# EAGLE design WaterMonitorV7.0 (EAGLE 7.4.0)
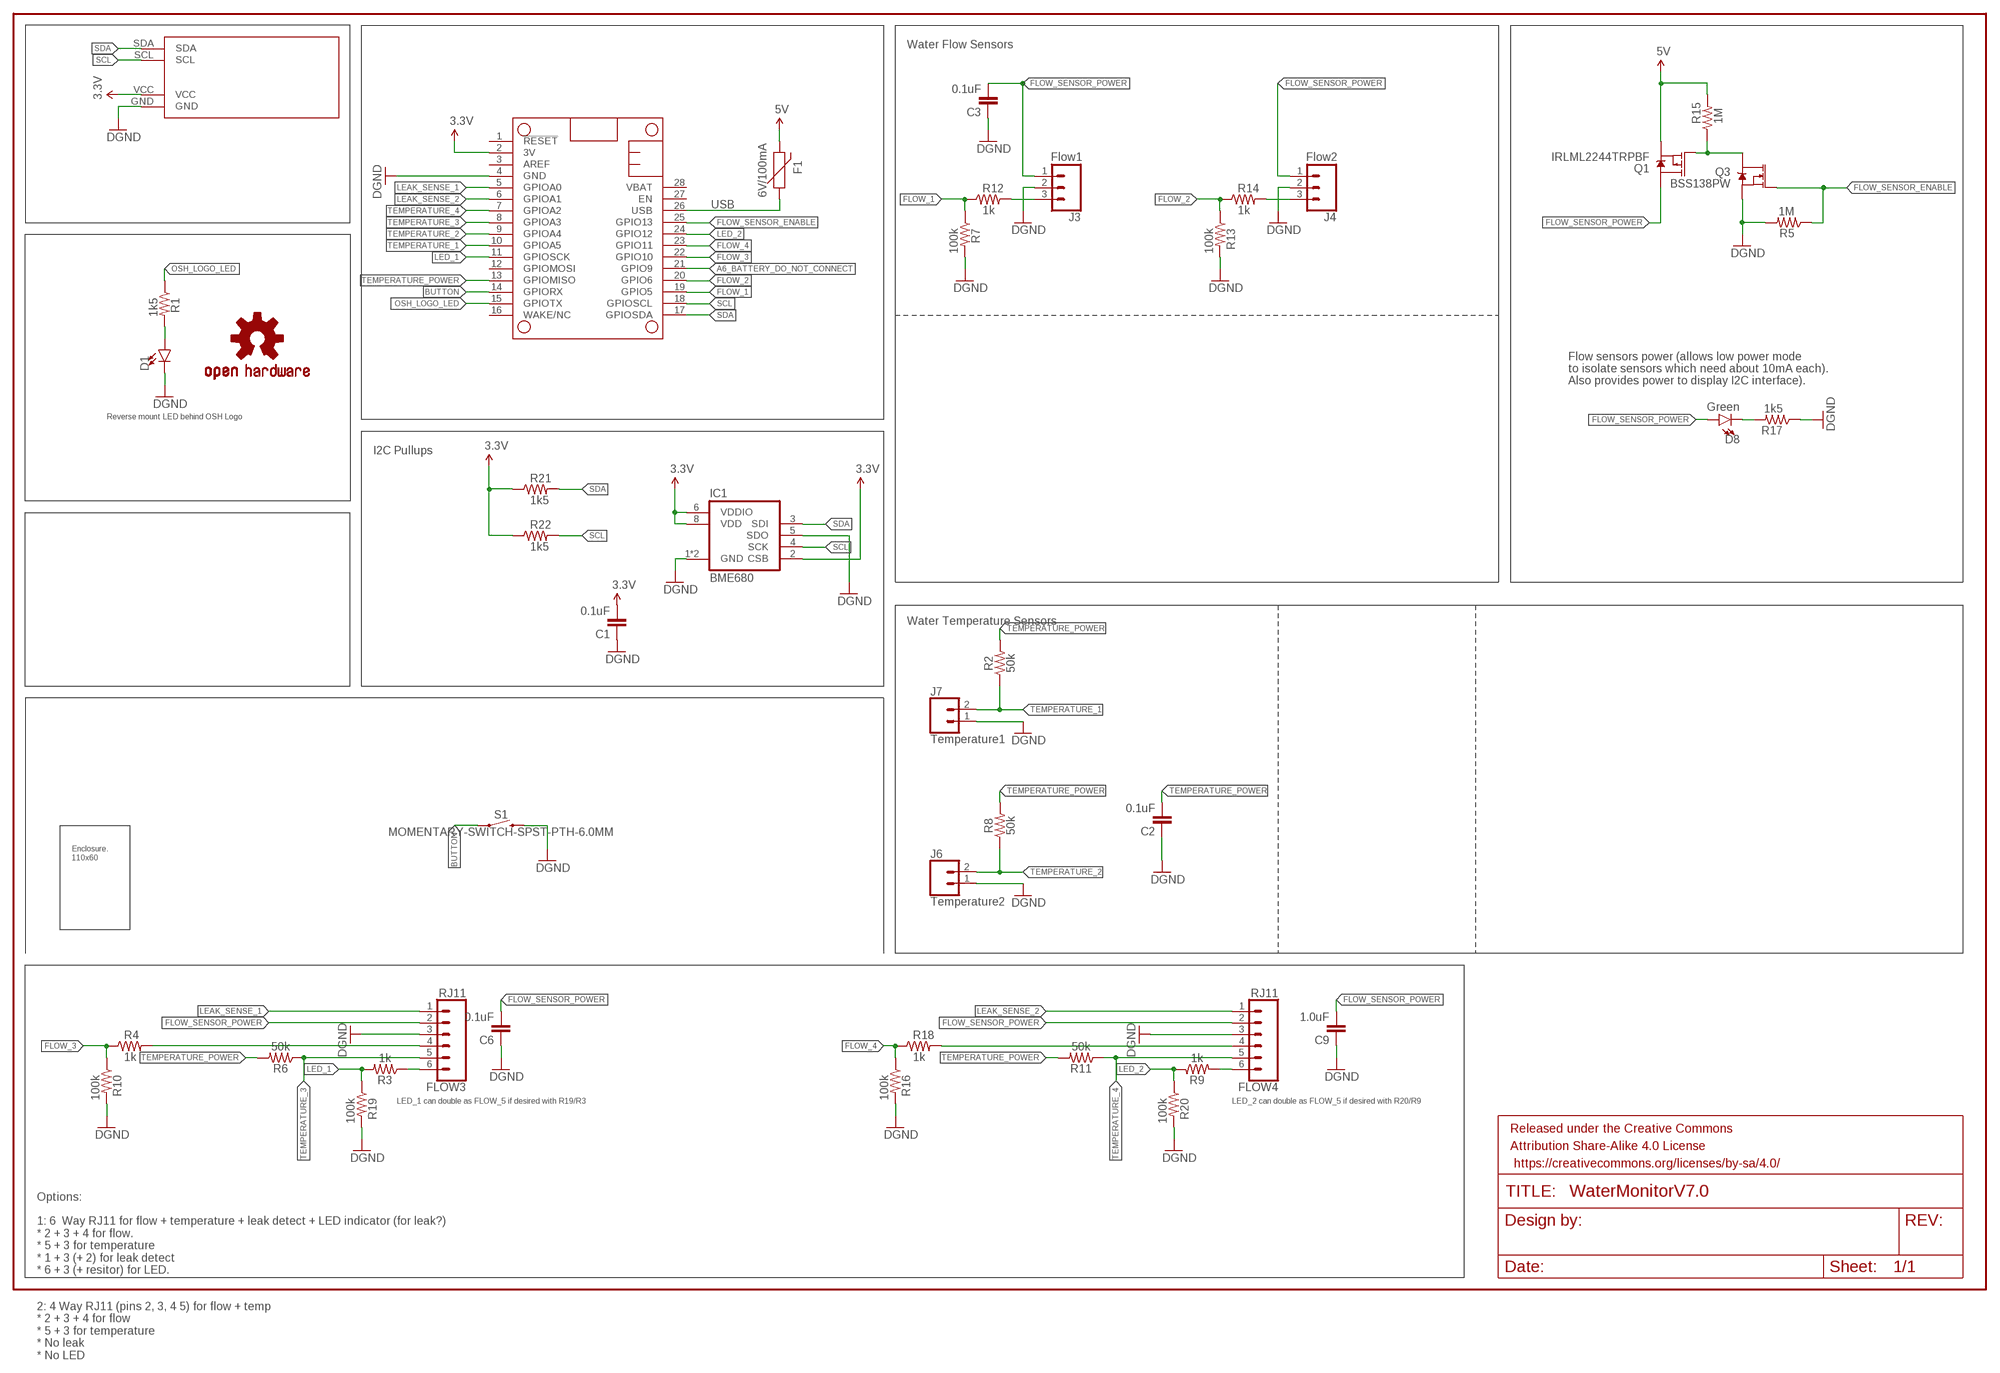
[diagram p0: schematic, sheet 1]

## Parts
C1  0.1uF  CAP0805  [0805]
C2  0.1uF  CAP0805  [0805]
C3  0.1uF  CAP0805  [0805]
C6  0.1uF  CAP0805  [0805]
C9  1.0uF  CAP0805  [0805]
D1  LED1206-BOTTOM  [LED-1206-BOTTOM]
D8  Green  LED-BLUE1206  [LED-1206]
F1  6V/100mA  PPTC_HALF-AMP  [1206]
FLOW3  RJ11  RJ11-6  [RJ11-6]
FLOW4  RJ11  RJ11-6  [RJ11-6]
FRAME2  FRAME-LEDGER  [CREATIVE_COMMONS]
IC1  BME680  [BME680]
J3  Flow1  CONN_03JST-HX-PTH-VERT  [JST-HX-3-PTH-VERT]
J4  Flow2  CONN_03JST-HX-PTH-VERT  [JST-HX-3-PTH-VERT]
J6  Temperature2  CONN_02POLAR  [MOLEX-1X2]
J7  Temperature1  CONN_02POLAR  [MOLEX-1X2]
LOGO1  OSHW-LOGOM  [OSHW-LOGO-M]
MS1  FEATHERWINGSIMPLE  [FEATHERWING_BREAKOUT_SIMPLE]
Q1  IRLML2244TRPBF  MOSFET_PCH-IRLML2244  [SOT23-3]
Q3  BSS138PW  MOSFET-NCH-BSS138  [SOT23-3]
R1  1k5  RESISTOR0805  [0805]
R2  50k  RESISTOR0805  [0805]
R3  1k  RESISTOR0805  [0805]
R4  1k  RESISTOR0805  [0805]
R5  1M  RESISTOR0805  [0805]
R6  50k  RESISTOR0805  [0805]
R7  100k  RESISTOR0805  [0805]
R8  50k  RESISTOR0805  [0805]
R9  1k  RESISTOR0805  [0805]
R10  100k  RESISTOR0805  [0805]
R11  50k  RESISTOR0805  [0805]
R12  1k  RESISTOR0805  [0805]
R13  100k  RESISTOR0805  [0805]
R14  1k  RESISTOR0805  [0805]
R15  1M  RESISTOR0805  [0805]
R16  100k  RESISTOR0805  [0805]
R17  1k5  RESISTOR0805  [0805]
R18  1k  RESISTOR0805  [0805]
R19  100k  RESISTOR0805  [0805]
R20  100k  RESISTOR0805  [0805]
R21  1k5  RESISTOR0805  [0805]
R22  1k5  RESISTOR0805  [0805]
S1  MOMENTARY-SWITCH-SPST-PTH-6.0MM  [TACTILE_SWITCH_PTH_6.0MM]
U$1  CAMDENBOSS-ENCLOSURE-110X60BOTH-EXTENDED-WIDE  [CAMDENBOSS_ENCLOSURE_110X60_WIDE_EXTENDED]
U$2  DISPLAY0.96_INCH_DISPLAY  [I2C_DISPLAY_0.96_INCH]

## Nets
3.3V: C1.2 IC1.2(CSB) IC1.6(VDDIO) IC1.8(VDD) MS1.2(3V) R21.1 R22.1 U$2.VCC
5V: F1.2 Q1.2(S) R15.2
A6_BATTERY_DO_NOT_CONNECT: MS1.21(GPIO9)
BUTTON: MS1.14(GPIORX) S1.1
FLOW_1: MS1.19(GPIO5) R7.1 R12.1
FLOW_2: MS1.20(GPIO6) R13.1 R14.1
FLOW_3: MS1.22(GPIO10) R4.1 R10.1
FLOW_4: MS1.23(GPIO11) R16.1 R18.1
FLOW_SENSOR_ENABLE: MS1.25(GPIO13) Q3.1(G) R5.1
FLOW_SENSOR_POWER: C3.2 C6.2 C9.2 D8.A FLOW3.2 FLOW4.2 J3.1 J4.1 Q1.3(D)
GND: C1.1 C2.1 C3.1 C6.1 C9.1 D1.C FLOW3.3 FLOW4.3 IC1.1(GND) IC1.5(SDO) IC1.7(GND) J3.2 J4.2 J6.1 J7.1 MS1.4(GND) Q3.2(S) R5.2 R7.2 R10.2 R13.2 R16.2 R17.1 R19.2 R20.2 S1.3 U$2.GND ; supply symbol labelled DGND
LEAK_SENSE_1: FLOW3.1 MS1.5(GPIOA0)
LEAK_SENSE_2: FLOW4.1 MS1.6(GPIOA1)
LED_1: MS1.11(GPIOSCK) R3.2 R19.1
LED_2: MS1.24(GPIO12) R9.1 R20.1
N$1: J3.3 R12.2
N$3: FLOW4.4 R18.2
N$4: FLOW3.4 R4.2
N$6: J4.3 R14.2
N$7: D8.C R17.2
N$11: FLOW3.6 R3.1
N$16: FLOW4.6 R9.2
N$19: Q1.1(G) Q3.3(D) R15.1
N$21: D1.A R1.2
OSH_LOGO_LED: MS1.15(GPIOTX) R1.1
SCL: IC1.4(SCK) MS1.18(GPIOSCL) R22.2 U$2.SCL
SDA: IC1.3(SDI) MS1.17(GPIOSDA) R21.2 U$2.SDA
TEMPERATURE_1: J7.2 MS1.10(GPIOA5) R2.1
TEMPERATURE_2: J6.2 MS1.9(GPIOA4) R8.1
TEMPERATURE_3: FLOW3.5 MS1.8(GPIOA3) R6.1
TEMPERATURE_4: FLOW4.5 MS1.7(GPIOA2) R11.1
TEMPERATURE_POWER: C2.2 MS1.13(GPIOMISO) R2.2 R6.2 R8.2 R11.2
USB: F1.1 MS1.26(USB)
Unconnected: MS1.1(!RESET) MS1.3(AREF) MS1.12(GPIOMOSI) MS1.16(WAKE/NC) MS1.27(EN) MS1.28(VBAT)

## Notes on the sheet
- Water Flow Sensors
- Flow sensors power (allows low power mode 
  to isolate sensors which need about 10mA each).
  Also provides power to display I2C interface).
- Reverse mount LED behind OSH Logo
- I2C Pullups
- Water Temperature Sensors
- LED_1 can double as FLOW_5 if desired with R19/R3 | LED_2 can double as FLOW_5 if desired with R20/R9
- Options:
  
  1: 6  Way RJ11 for flow + temperature + leak detect + LED indicator (for leak?)
  * 2 + 3 + 4 for flow.
  * 5 + 3 for temperature
  * 1 + 3 (+ 2) for leak detect
  * 6 + 3 (+ resitor) for LED.
  
  
  2: 4 Way RJ11 (pins 2, 3, 4 5) for flow + temp
  * 2 + 3 + 4 for flow
  * 5 + 3 for temperature
  * No leak
  * No LED

## Library data of the parts
C1-C3 C6 C9 = SparkFun-Passives:CAP: Capacitor Standard 0603 ceramic capacitor, and 0.1" leaded capacitor.
D1 = SparkFun-LED:LED: LED (Generic) Standard schematic elements and footprints for 5mm, 3mm, 1206, and 0603 sized LEDs. Generic LEDs with no color specified.
D8 = SparkFun-LED:LED-BLUE: Blue SMD LED Used in manufacturing of various products at SparkFun Packages: 0603 - SMD 0603 package [Product Link] <http://www.digikey.com/product-detail/en/SMLE12BC7TT86/511-1589-2-ND/1641808> 1206 - SMD1206 package [Product Link] <http://www.digikey.com/product-detail/en/lite-on-inc/LTST-C150TBKT/160-1643-1-ND/573584> SparkFun Products: ESP8266 Thing-Dev Board <https://www.sparkfun.com/products/13711> RedBoard <https://www.sparkfun.com/products/12757>; PROD_ID: DIO-09911; VALUE: BLUE
F1 = SparkFun-Fuses:PPTC: Resettable Fuse PPTC Resettable Fuse. Really a sort of resistor with a polymeric positive temperature coefficient whose resistance increases dramatically with an increase in temperature. When heated by the power passing through the resistance rises causing the current to be limited, protecting the circuit. This is achieved by the transition of the polymer from a crystalline to an amorphous state where the conductive carbon separates breaking the conductive pathways found in the cool crystalline structure. When a PPTC cools back down it resumes conducting letting the circuit turn back on. SparkFun Products: SparkFun RedBoard - Programmed with Arduino <https://www.sparkfun.com/products/12757> Pro Micro - 5V/16MHz <https://www.sparkfun.com/products/12640> Arduino Pro 328 - 5V/16MHz <https://www.sparkfun.com/products/10915> MP3 Trigger <https://www.sparkfun.com/products/13720>; PROD_ID: RES-08585; VALUE: 6V/0.5A
FLOW3 FLOW4 = SparkFun-Connectors:RJ11-6: RJ11 Jack - 6 pin Commonly found on CAT3 devices and some Microchip programmers. Here is the connector we sell at SparkFun: RJ11 6-Pin Connector <https://www.sparkfun.com/products/132> (PRT-00132) Datasheet <http://www.sparkfun.com/datasheets/Prototyping/Connectors/RJ11-Datasheet.pdf> It is used on this SparkFun product: SparkFun Weather Shield <https://www.sparkfun.com/products/12081> (DEV-12081) Weather Meters <https://www.sparkfun.com/products/8942> (SEN-08942); PROD_ID: CONN-08590; SF_ID: PRT-00132
FRAME2 = SparkFun-Aesthetics:FRAME-LEDGER: Schematic Frame Standard 11x14 US Ledger frame
IC1 = ThingySticks:BME680: BME680 integrates for the first time individual high linearity and high accuracy sensors for gas, pressure, humidity and temperature. The library has been designed by Richard Magdycz <https://www.facebook.com/groups/eaglecadsoftUK> Original version had pins in incorrect places (BME680 uses untypical clockwise direction). Updated 17 Feb 2018 S.Harrison ThingySticks.com
J3 J4 = Tinamous:CONN_03: Multi connection point. Often used as Generic Header-pin footprint for 0.1 inch spaced/style header connections On any of the 0.1 inch spaced packages, you can populate with these: Break Away Headers - Straight <https://www.sparkfun.com/products/116> (PRT-00116) Break Away Male Headers - Right Angle <https://www.sparkfun.com/products/553> (PRT-00553) Female Headers <https://www.sparkfun.com/products/115> (PRT-00115) Break Away Headers - Machine Pin <https://www.sparkfun.com/products/117> (PRT-00117) Break Away Female Headers - Swiss Machine Pin <https://www.sparkfun.com/products/743> (PRT-00743) Stackable Header - 3 Pin (Female, 0.1") <https://www.sparkfun.com/products/13875> (PRT-13875) For SCREWTERMINALS and SPRING TERMINALS visit here: Screw Terimnals on SparkFun.com <https://www.sparkfun.com/search/results?term=Screw+Terminals> (5mm/3.5mm/2.54mm spacing) This device is also useful as a general connection point to wire up your design to another part of your project. Our various solder wires solder well into these plated through hole pads. Hook-Up Wire - Assortment (Stranded, 22 AWG) <https://www.sparkfun.com/products/11375> (PRT-11375) Hook-Up Wire - Assortment (Solid Core, 22 AWG) <https://www.sparkfun.com/products/11367> (PRT-11367) View the entire wire category on our website here <https://www.sparkfun.com/categories/141> Special notes: Molex polarized connector foot print use with SKU : PRT-08232 with associated crimp pins and housings.; FARNELL: 1516227
J6 J7 = SparkFun-Connectors:CONN_02: Multi connection point. Often used as Generic Header-pin footprint for 0.1 inch spaced/style header connections On any of the 0.1 inch spaced packages, you can populate with these: Break Away Headers - Straight <https://www.sparkfun.com/products/116> (PRT-00116) Break Away Male Headers - Right Angle <https://www.sparkfun.com/products/553> (PRT-00553) Female Headers <https://www.sparkfun.com/products/115> (PRT-00115) Break Away Headers - Machine Pin <https://www.sparkfun.com/products/117> (PRT-00117) Break Away Female Headers - Swiss Machine Pin <https://www.sparkfun.com/products/743> (PRT-00743) For SCREWTERMINALS and SPRING TERMINALS visit here: Screw Terimnals on SparkFun.com <https://www.sparkfun.com/search/results?term=Screw+Terminals> (5mm/3.5mm/2.54mm spacing) This device is also useful as a general connection point to wire up your design to another part of your project. Our various solder wires solder well into these plated through hole pads. Hook-Up Wire - Assortment (Stranded, 22 AWG) <https://www.sparkfun.com/products/11375> (PRT-11375) Hook-Up Wire - Assortment (Solid Core, 22 AWG) <https://www.sparkfun.com/products/11367> (PRT-11367) View the entire wire category on our website here <https://www.sparkfun.com/categories/141> Special notes: Molex polarized connector foot print use with: PRT-08233 with associated crimp pins and housings. 2.54_SCREWTERM for use with PRT-10571. 3.5mm Screw Terminal footprints for PRT-08084 5mm Screw Terminal footprints for use with PRT-08432; SF_ID: PRT-09918
LOGO1 = SparkFun-Aesthetics:OSHW-LOGO: Open Source Hardware Logo This logo indicates the piece of hardware it is found on incorporates a OSHW license and/or adheres to the definition of open source hardware found here: http://freedomdefined.org/OSHW
MS1 = ThingySticks:FEATHERWING
Q1 = SparkFun-DiscreteSemi:MOSFET_PCH: P-channel MOSFETs Voltage controlled devices that allow control of high current outputs. SparkFun Products: SparkFun ESP32 Thing <https://www.sparkfun.com/products/13907> SparkFun ESP8266 Thing <https://www.sparkfun.com/products/13231>; FARNELL: 2468051; PROD_ID: TRANS-11153; VALUE: 4.3A/20V/54mΩ
Q3 = SparkFun-DiscreteSemi:MOSFET-NCH: N-channel MOSFETs Voltage controlled devices that allow control of high current outputs. SparkFun Products: SparkFun OpenScale <https://www.sparkfun.com/products/13261> SparkFun Digital Sandbox <https://www.sparkfun.com/products/12651> SparkFun Monster Moto Shield <https://www.sparkfun.com/products/10182> SparkFun MOSFET Power Controller <https://www.sparkfun.com/products/11214>; FARNELL: 1907611; PROD_ID: TRANS-00830; VALUE: 220mA/50V/3.5Ω
R1-R22 = SparkFun-Resistors:RESISTOR: Generic Resistor Package
S1 = SparkFun-Switches:MOMENTARY-SWITCH-SPST: Momentary Switch (Pushbutton) - SPST Normally-open (NO) SPST momentary switches (buttons, pushbuttons). Variants PTH-12MM - 12mm square, through-hole Momentary Pushbutton Switch - 12mm Square <https://www.sparkfun.com/products/9190> (COM-09190) PTH-6.0MM, PTH-6.0MM-KIT - 6.0mm square, through-hole Mini Pushbutton Switch <https://www.sparkfun.com/products/97> (COM-00097) KIT package intended for soldering kit's - only one side of pads' copper is exposed. PTH-RIGHT-ANGLE-KIT - Right-angle, through-hole Right Angle Tactile Button <https://www.sparkfun.com/products/10791> - Used on SparkFun BigTime Watch Kit <https://www.sparkfun.com/products/11734> SMD-12MM - 12mm square, surface-mount Tactile Button - SMD (12mm) <https://www.sparkfun.com/products/12993> (COM-12993) Used on SparkFun PicoBoard <https://www.sparkfun.com/products/11888> SMD-4.5MM - 4.5mm Square Trackball Switch Used on SparkFun Blackberry Trackballer Breakout <https://www.sparkfun.com/products/13169> SMD-4.6MMX2.8MM - 4.60mm x 2.80mm, surface mount Used on SparkFun SAMD21 Mini Breakout <https://www.sparkfun.com/products/13664> SMD-5.2MM, SMD-5.2-REDUNDANT - 5.2mm square, surface-mount Mini Pushbutton Switch - SMD <https://www.sparkfun.com/products/8720> (COM-08720) Used on Arduino Pro Mini <https://www.sparkfun.com/products/11114> REDUNDANT package connects both switch circuits together SMD-6.0X3.5MM - 6.0 x 3.5mm, surface mount Momentary Reset Switch SMD <https://www.sparkfun.com/products/8229> (COM-08229) SMD-6.2MM-TALL - 6.2mm square, surface mount Tactile Button - SMD (6mm) <https://www.sparkfun.com/products/12992> Used on SparkFun Digital Sandbox <https://www.sparkfun.com/products/12651> SMD-RIGHT-ANGLE - Right-angle, surface mount Used on SparkFun Block for Intel® Edison - Arduino <https://www.sparkfun.com/products/13036>; PROD_ID: SWCH-08441; SF_SKU: COM-00097
U$1 = ThingySticks:CAMDENBOSS-ENCLOSURE-110X60
U$2 = ThingySticks:DISPLAY

## Board
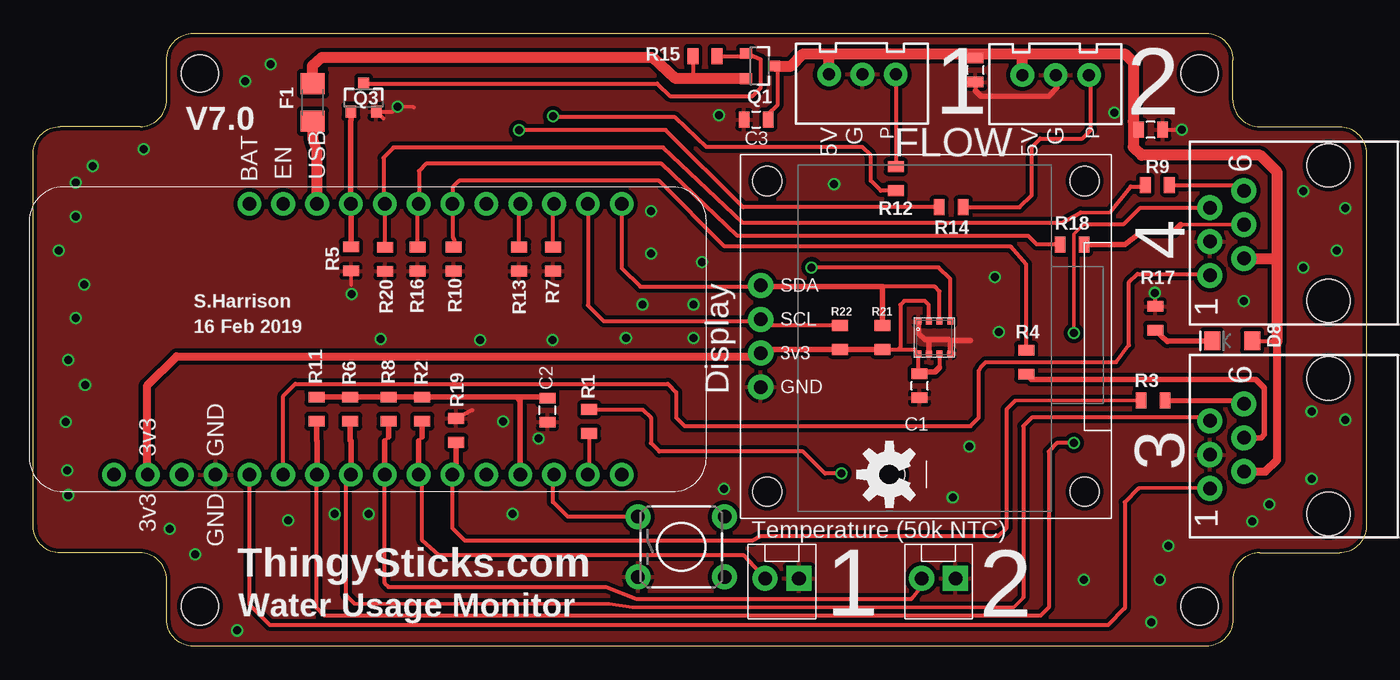
[diagram p1: board, top side]
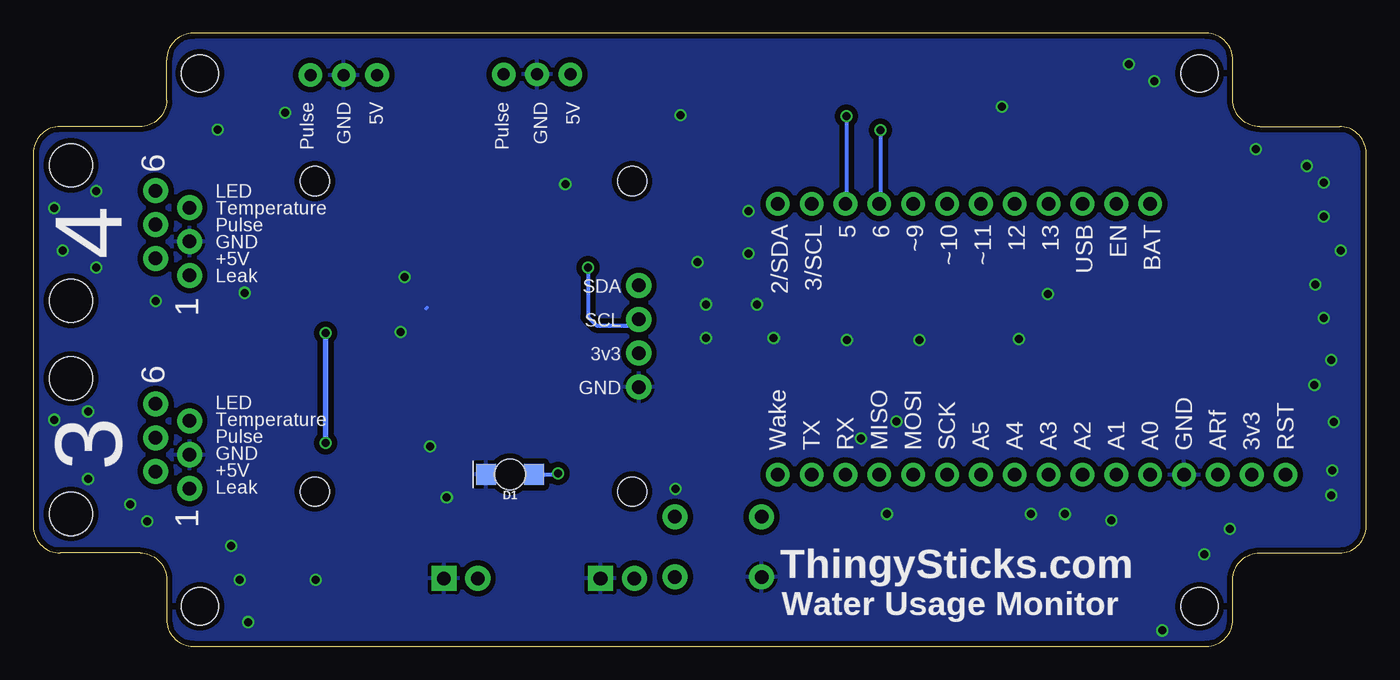
[diagram p2: board, bottom side, seen from below]

Size 100 x 46 mm. Coordinates in mm from the lower left corner, seen from the top.
Copper layers (1*16): Top 0.035mm / dielectric 1.5mm / Bottom 0.035mm
Design rules "dirt_cheap_dirty_boards.v1.1": minimum track width 6mil, minimum drill 12mil, track to track 6mil, track to pad 6mil, pad to pad 6mil, via to via 6mil, smd to smd 0mil, copper to edge 10mil, drill to drill 10mil, minimum pad ring 10mil, minimum via ring 6mil, stop-mask expansion 2mil, vias tented up to drill 25mil, thermal gap 10mil

### Footprints (pad centres in the part's own frame; a part is rotated, then mirrored left to right if it is on the bottom)
0805 = smd 0.8 x 1.2: 1 -0.9,0; 2 0.9,0
LED-1206-BOTTOM = smd 1.5 x 1.6: A -1.8,0; C 1.8,0 | hole 2.3: 0,0
LED-1206 = smd 1.2 x 1.4: A -1.5,0; C 1.5,0
1206 = smd 1.6 x 1.8: 1 -1.4,0; 2 1.4,0
RJ11-6 = drill 1.016 pad 1.88: 1 -3.175,8.89; 2 -1.905,6.35; 3 -0.635,8.89; 4 0.635,6.35; 5 1.905,8.89; 6 3.175,6.35 | hole 3.251: -5.08,0; 5.08,0
BME680 = smd 0.45 x 0.45: 1 1.2,-1.2; 2 0.4,-1.2; 3 -0.4,-1.2; 4 -1.2,-1.2; 5 -1.2,1.2; 6 -0.4,1.2; 7 0.4,1.2; 8 1.2,1.2
JST-HX-3-PTH-VERT = drill 0.9 pad 1.778: 1 7.5,2.35; 2 5,2.35; 3 2.5,2.35
MOLEX-1X2 = drill 1.016 pad 1.88 square: 1 0,0 | drill 1.016 pad 1.88: 2 2.54,0
FEATHERWING_BREAKOUT_SIMPLE = drill 1 pad 1.778: 1 6.35,1.27; 2 8.89,1.27; 3 11.43,1.27; 4 13.97,1.27; 5 16.51,1.27; 6 19.05,1.27; 7 21.59,1.27; 8 24.13,1.27; 9 26.67,1.27; 10 29.21,1.27; 11 31.75,1.27; 12 34.29,1.27; 13 36.83,1.27; 14 39.37,1.27; 15 41.91,1.27; 16 44.45,1.27; 17 44.45,21.59; 18 41.91,21.59; 19 39.37,21.59; 20 36.83,21.59; 21 34.29,21.59; 22 31.75,21.59; 23 29.21,21.59; 24 26.67,21.59; 25 24.13,21.59; 26 21.59,21.59; 27 19.05,21.59; 28 16.51,21.59
SOT23-3 = smd 0.8 x 0.9: 1 -0.95,-1; 2 0.95,-1; 3 0,1.1
TACTILE_SWITCH_PTH_6.0MM = drill 1.016 pad 1.88: 1 -3.251,2.261; 2 3.251,2.261; 3 -3.251,-2.261; 4 3.251,-2.261
CAMDENBOSS_ENCLOSURE_110X60_WIDE_EXTENDED = hole 2.8: 43,2.5; 43,77.5; 3,77.5; 3,2.5
I2C_DISPLAY_0.96_INCH = drill 1.016 pad 1.88: GND 9.84,26.3; SCL 14.92,26.3; SDA 17.46,26.3; VCC 12.38,26.3 | hole 2.2: 2,25.8; 25.3,25.8; 2,2; 25.3,2

### Placement (x,y rotation side)
C1  66.5,19.54 90 top
C2  38.57,17.72 90 top
C3  54.23,39.53 0 top
C6  70.69,43.25 90 top
C9  83.83,38.77 180 top
D1  64.23,12.9 180 bottom
D8  89.94,22.92 180 top
F1  20.97,40.81 90 top
FLOW3  97.17,15.01 90 top
FLOW4  97.17,31.01 90 top
FRAME2  16.52,-14.12 0 top  (outside the outline)
IC1  67.59,23.17 180 top
J3  67.2,45.27 180 top
J4  81.7,45.22 180 top
J6  69.19,5.09 180 top
J7  57.44,5.09 180 top
LOGO1  64.23,12.89 90 top
MS1  -0.3,11.6 0 top
Q1  54.48,43.55 270 top
Q3  24.78,41.13 0 top
R1  41.7,16.86 90 top
R2  29.18,17.79 90 top
R3  84.02,18.45 180 top
R4  74.5,21.32 270 top
R5  23.83,29.07 270 top
R6  23.79,17.79 90 top
R7  38.99,29.06 270 top
R8  26.64,17.79 90 top
R9  84.34,34.61 0 top
R10  31.55,29.06 270 top
R11  21.25,17.79 90 top
R12  64.72,35.09 90 top
R13  36.45,29.06 270 top
R14  68.86,32.94 0 top
R15  50.4,44.28 180 top
R16  28.83,29.06 270 top
R17  84.16,24.61 270 top
R18  77.93,30.16 0 top
R19  31.72,16.19 90 top
R20  26.39,29.04 270 top
R21  63.7,23.17 90 top
R22  60.5,23.17 90 top
S1  48.62,7.45 0 top
U$1  90,0 90 top
U$2  80.87,9.61 90 top

### Tracks (layer width: path | path; a pad name or v marks a point on that pad's centre or on a via)
3.3V
  Top 0.254: 66.42,21.94 IC1.8 | 65.05,22.43 64.9,22.28
  Top 0.305: R21.1 64.9,22.28 66.09,22.28 IC1.8 | IC1.6 67.99,20.93 | 66.42,20.74 66.42,21.94 | IC1.2 67.19,25.61 66.88,25.92 65.35,25.92 65.05,25.61 65.05,22.43 | 66.57,20.58 66.57,20.52 C1.2
  Top 0.406: 67.99,20.93 67.64,20.58 66.57,20.58 66.42,20.74 | R21.1 R22.1 55.49,22.28 U$2.VCC
  Top 0.61: 8.51,12.95 8.51,19.52 10.74,21.75 54.33,21.75 U$2.VCC
  Top 1.016: 8.51,12.95 MS1.2
5V
  Top 0.305: R15.2 49.5,42.61 49.5,42.6
  Top 0.813: Q1.2 49.5,42.6 48.19,42.6 46.48,44.16 21.64,44.18 20.93,43.55 20.93,42.25 F1.2
BUTTON
  Top 0.305: S1.1 40.11,9.71 38.99,10.83 38.99,12.79 MS1.14
FLOW_1  (via drill 0.6)
  Top 0.305: R7.1 38.99,33.11 MS1.19 | v38.99,39.79 39.2,39.7 48.15,39.7 50.52,37.48 62.2,37.48 62.84,36.84 62.84,34.93 63.58,34.19 R12.1
  Bottom 0.305: v38.99,39.79 38.99,33.27 MS1.19
FLOW_2  (via drill 0.6)
  Top 0.305: R14.1 53.25,32.94 47.45,38.74 36.63,38.74 v36.45,38.72 | R13.1 36.45,33.11 MS1.20
  Bottom 0.305: v36.45,38.72 36.45,33.27 MS1.20
FLOW_3
  Top 0.305: R4.1 74.5,28.66 73.33,29.98 51.97,30.01 51.87,30.01 46.94,34.93 31.95,34.93 31.47,34.45 31.47,33.22 | 31.47,33.22 MS1.22 | 31.47,33.22 31.47,30.74 31.57,30.49 31.72,30.24 R10.1
FLOW_4
  Top 0.305: R18.1 75.29,30.16 74.65,30.8 52.83,30.8 47.12,36.2 29.46,36.2 28.93,35.67 28.93,33.22 MS1.23 28.83,33.11 R16.1
FLOW_SENSOR_ENABLE
  Top 0.406: MS1.25 23.83,33.14 | 23.83,33.14 R5.1 | Q3.1 23.83,39.54 23.81,39.35 23.81,33.46 23.83,33.14
FLOW_SENSOR_POWER
  Top 0.254: Q1.3 55.85,43.28
  Top 0.305: D8.A 93.27,22.92 93.32,22.87 | C3.2 55.13,39.92 55.85,40.65 55.85,43.28 | C9.2 82.68,39.23 82.52,39.38 | C6.2 70.69,44.23 70.46,44.46
  Top 0.61: FLOW3.2 92.44,13.11 93.32,13.98 93.32,22.87
  Top 0.813: 93.32,22.87 93.32,29.22 | 93.32,29.22 93.32,35.57 92.05,36.84 83.16,36.84 82.52,37.48 82.52,39.38 82.52,43.82 81.89,44.46 74.27,44.46 | FLOW4.2 93.2,29.11 93.32,29.22 | Q1.3 56.85,43.55 57.76,44.46 59.66,44.46 | 59.66,44.46 70.46,44.46 74.27,44.46 | J3.1 59.7,44.42 59.66,44.46 | J4.1 74.2,44.39 74.27,44.46
GND  (via drill 0.6)
  Top 0.254: IC1.7 | 66.42,24.34 IC1.1 | 68.79,22.94 68.71,23.02 | R5.2 23.83,27.12
  Top 0.305: 28.54,40.44 v27.32,40.49 26.95,40.13 Q3.2 26.26,39.6 | R17.1 84.16,26.07 v84.14,26.53 | C6.1 70.69,41.69 | 76.81,42.77 J4.2 | C9.1 85.7,38.77 v86.18,38.77 | R19.2 32.93,17.73
  Top 0.406: 70.69,41.69 71.09,41.28 76.17,41.28 76.81,41.92 76.81,42.77 | IC1.7 67.18,23.02 | 67.18,23.02 66.88,23.02 66.42,23.48 66.42,24.34 | IC1.5 68.79,22.94 70.32,22.94 | 68.71,23.02 67.18,23.02
  Bottom 0.254: 70.54,25.33 70.46,25.41
  other vias: 37.9,15.58 23.89,26.42 51.45,39.86 35.23,16.88 3.19,32.24 1.92,29.7 3.82,27.16 3.19,24.62 26.05,23.07 3.88,19.59 2.43,16.82 2.55,13.19 72.44,23.58 33.52,22.97 10.23,8.8 12.13,6.89 2.61,11.34 3.19,34.78 4.46,36.05 8.27,37.32 17.79,43.67 98.44,32.88 97.8,29.7 90.82,25.89 98.44,17 95.9,12.55 92.72,10.65 91.45,9.38 95.9,17.64 95.27,34.14 95.27,28.43 2.61,21.5 81.1,40.04 19.12,9.43 15.89,42.4 72.15,27.69 45.72,25.66 49.53,25.66 46.36,29.47 46.36,32.65 50.17,28.84 49.53,23.12 44.45,23.12 38.97,22.99 70.25,14.99 68.98,11.18 51.83,11.82 60.09,34.68 35.96,9.91 25.16,9.91 22.62,9.91 15.31,1.18 83.89,1.81 84.52,4.99 85.16,7.53 78.81,4.99
  pour Bottom (isolate 0.406, rank 6): 7.3,38.98 8.77,38.98 9.88,40.09 9.89,44.11 10.92,45.91 86.08,46.06 88.06,46.03 arc-90 90.14,43.95 90.14,40.65 arc90 91.94,39.01 97.83,39.01 arc-90 99.95,36.89 100,34.96 100.15,10.96 100.2,9.54 arc-90 97.94,6.72 92.05,7 arc90 90.14,5.09 90.14,1.92 arc-90 88.1,-0.13 87.35,-0.13 17.81,-0.1 12.04,0.01 arc-90 10.13,1.92 10.13,4.69 arc90 7.71,7.12 1.12,7.12 -0.03,8.27 0.1,37.63 arc-90 1.37,38.9 4.3,39.07
  pour Top (isolate 0.305, rank 3): 88.24,46.36 11.4,46.36 arc90 10.13,45.09 10.13,40.65 arc-90 8.23,38.74 1.24,38.74 arc90 -0.03,37.48 -0.03,8.9 arc90 1.88,7 8.23,7 arc-90 10.13,5.09 10.13,2.55 arc90 12.67,0.01 88.24,0.01 arc90 90.14,1.92 90.14,5.09 arc-90 92.05,7 98.4,7 arc90 100.3,8.9 100.3,36.84 arc90 98.4,38.74 92.05,38.74 arc-90 90.14,40.65 90.14,44.46 arc90
LEAK_SENSE_1
  Top 0.305: FLOW3.1 88.28,11.59 87.96,11.9 82.92,11.83 81.89,10.8 81.89,2.83 81.86,2.83 80.62,1.58 17.75,1.58 16.21,3.13 MS1.5
LEAK_SENSE_2
  Top 0.305: MS1.6 18.75,18.78 19.66,19.7 47.6,19.7 48.23,19.06 48.23,17.16 48.87,16.52 70.31,16.52 70.94,17.16 70.94,20.69 71.09,20.96 71.45,21.32 81.25,21.32 82.21,22.59 82.21,27.32 82.84,27.95 88.17,27.95 FLOW4.1
LED_1
  Top 0.305: R3.2 73.66,18.43 73.02,17.79 73.02,8.9 72.39,8.27 54.58,8.27 53.95,7.93 32.36,7.93 31.45,8.85 MS1.11 31.72,13.15
  Top 0.406: R19.1 31.72,13.15
LED_2
  Top 0.305: R9.1 83.14,34.48 82.33,34.5 80.8,32.57 78.59,32.55 77.11,31.76 53.24,31.76 47.24,37.42 27.03,37.42 26.26,36.66 26.26,33.3 MS1.24 26.39,33.17 R20.1
N$1
  Top 0.305: J3.3 64.7,36 R12.2
N$3
  Top 0.254: FLOW4.4 86.08,31.65
  Top 0.406: R18.2 81.89,30.16 83.16,31.12 85.56,31.12 86.08,31.65
N$4
  Top 0.406: FLOW3.4 92.11,15.64 92.35,15.88 92.35,19.39 91.72,20.03 74.89,20.03 R4.2
N$6
  Top 0.305: R14.2 73.99,32.94 74.91,33.84 74.91,37.48 75.54,38.11 78.71,38.11 79.35,38.74 79.35,42.73 J4.3
N$7
  Top 0.406: D8.C 85.12,22.92 85.06,22.87 R17.2
N$11
  Top 0.406: R3.1 89.95,18.43 FLOW3.6
N$16
  Top 0.305: R9.2 90.4,34.61
  Top 0.406: 90.4,34.61 FLOW4.6
N$19
  Top 0.305: 24.73,42.23 Q3.3 46.81,42.23 47.75,41.28 53.95,41.28 54.58,41.92 54.58,44.03 Q1.1 53.27,44.28 R15.1
N$21  (via drill 0.6)
  Top 0.305: v60.63,12.96 59.41,12.96 57.76,14.62 46.96,14.62 46.33,15.25 46.33,17.16 45.72,17.77 R1.2
  Bottom 0.305: D1.A 60.7,12.9 v60.63,12.96
OSH_LOGO_LED
  Top 0.305: R1.1 41.7,12.96 MS1.15
SCL  (via drill 0.6)
  Top 0.254: 55,24.39 U$2.SCL
  Top 0.305: R22.2 55.32,24.08 U$2.SCL | MS1.18 41.61,25.59 42.8,24.39 55,24.39 | IC1.4 68.79,27.56 67.92,28.43 v58.39,28.43 | 52.4,24.39 54.44,24.39
  Top 0.406: 54.44,24.39 U$2.SCL
  Bottom 0.305: v58.39,28.43 58.39,24.71 57.76,24.08 55.03,24.08 U$2.SCL
SDA
  Top 0.305: MS1.17 44.15,28.38 45.54,26.99 54.31,26.99 | IC1.3 67.99,26.64 67.64,26.99 63.7,26.99
  Top 0.406: 54.31,26.99 U$2.SDA 54.66,26.99 63.7,26.99 R21.2
TEMPERATURE_1
  Top 0.254: 29.18,15.69 28.91,15.41
  Top 0.305: 54.89,5.09 53.31,6.82 30.45,6.82 29.18,7.93 29.18,12.6 MS1.10
  Top 0.406: MS1.10 28.91,15.41 | R2.1 29.18,15.69 | J7.2 54.89,5.09
TEMPERATURE_2
  Top 0.254: 26.64,15.69 26.37,15.41
  Top 0.305: 66.65,4.46 65.91,3.57 45.26,3.54 42.95,4.46 26.64,4.46 26.37,4.73 MS1.9
  Top 0.406: MS1.9 26.37,15.41 | R8.1 26.64,15.69 | 66.65,4.46 J6.2
TEMPERATURE_3
  Top 0.254: 74.27,3.64 73.56,2.93 44.96,2.93 43.18,3.18 24.1,3.18
  Top 0.305: 87.6,17.16 74.91,17.16 74.27,16.52 74.27,3.64 | 24.1,3.18 23.47,3.82 23.47,12.52 MS1.8 | 23.79,15.45 23.83,15.41
  Top 0.406: MS1.8 23.83,15.41 | FLOW3.5 88,16.92 87.6,17.16 | R6.1 23.79,15.45
TEMPERATURE_4  (via drill 0.6)
  Top 0.254: 78.78,31.65 78.08,30.95 v78.08,23.51
  Top 0.305: 21.25,15.45 21.29,15.41 | 87.45,32.88 83.01,32.88 81.77,31.65 78.78,31.65 | MS1.7 21.25,12.83 21.25,2.87 21.82,2.3 75.56,2.3 76.17,2.91 76.17,14.62 76.81,15.25 v78.08,15.25
  Top 0.406: MS1.7 21.29,15.41 | R11.1 21.25,15.45 | FLOW4.5 87.72,32.91 87.45,32.88
  Bottom 0.406: v78.08,23.51 v78.08,15.25
TEMPERATURE_POWER
  Top 0.406: R11.2 R6.2 R8.2 R2.2 36.25,18.69 | 36.25,18.69 38.49,18.69 C2.2 | MS1.13 36.53,18.41 36.25,18.69
USB
  Top 0.813: F1.1 20.97,38.07 21.26,37.14 21.26,33.77 MS1.26
  Top 1.016: 21.31,33.17 MS1.26

### Text on the board
tNames: V7.0 | 1 | 2 | 5V | G | P | FLOW | 5V | G | P | 6 | 4 | SDA | S.Harrison | 1 | SCL | 16 Feb 2019 | 3v3 | 6 | Display | GND | 3 | 1 | Temperature (50k NTC) | ThingySticks.com | Water Usage Monitor | 1 | 2
bNames: 5V | GND | Pulse | 5V | GND | Pulse | 6 | LED | Temperature | Pulse | GND | +5V | 4 | SDA | Leak | SCL | 1 | 3v3 | GND | 6 | LED | Temperature | Pulse | GND | +5V | 3 | Leak | 1 | ThingySticks.com | Water Usage Monitor